# EAGLE design PLC_32u4_REV-A (EAGLE 8.6.3)
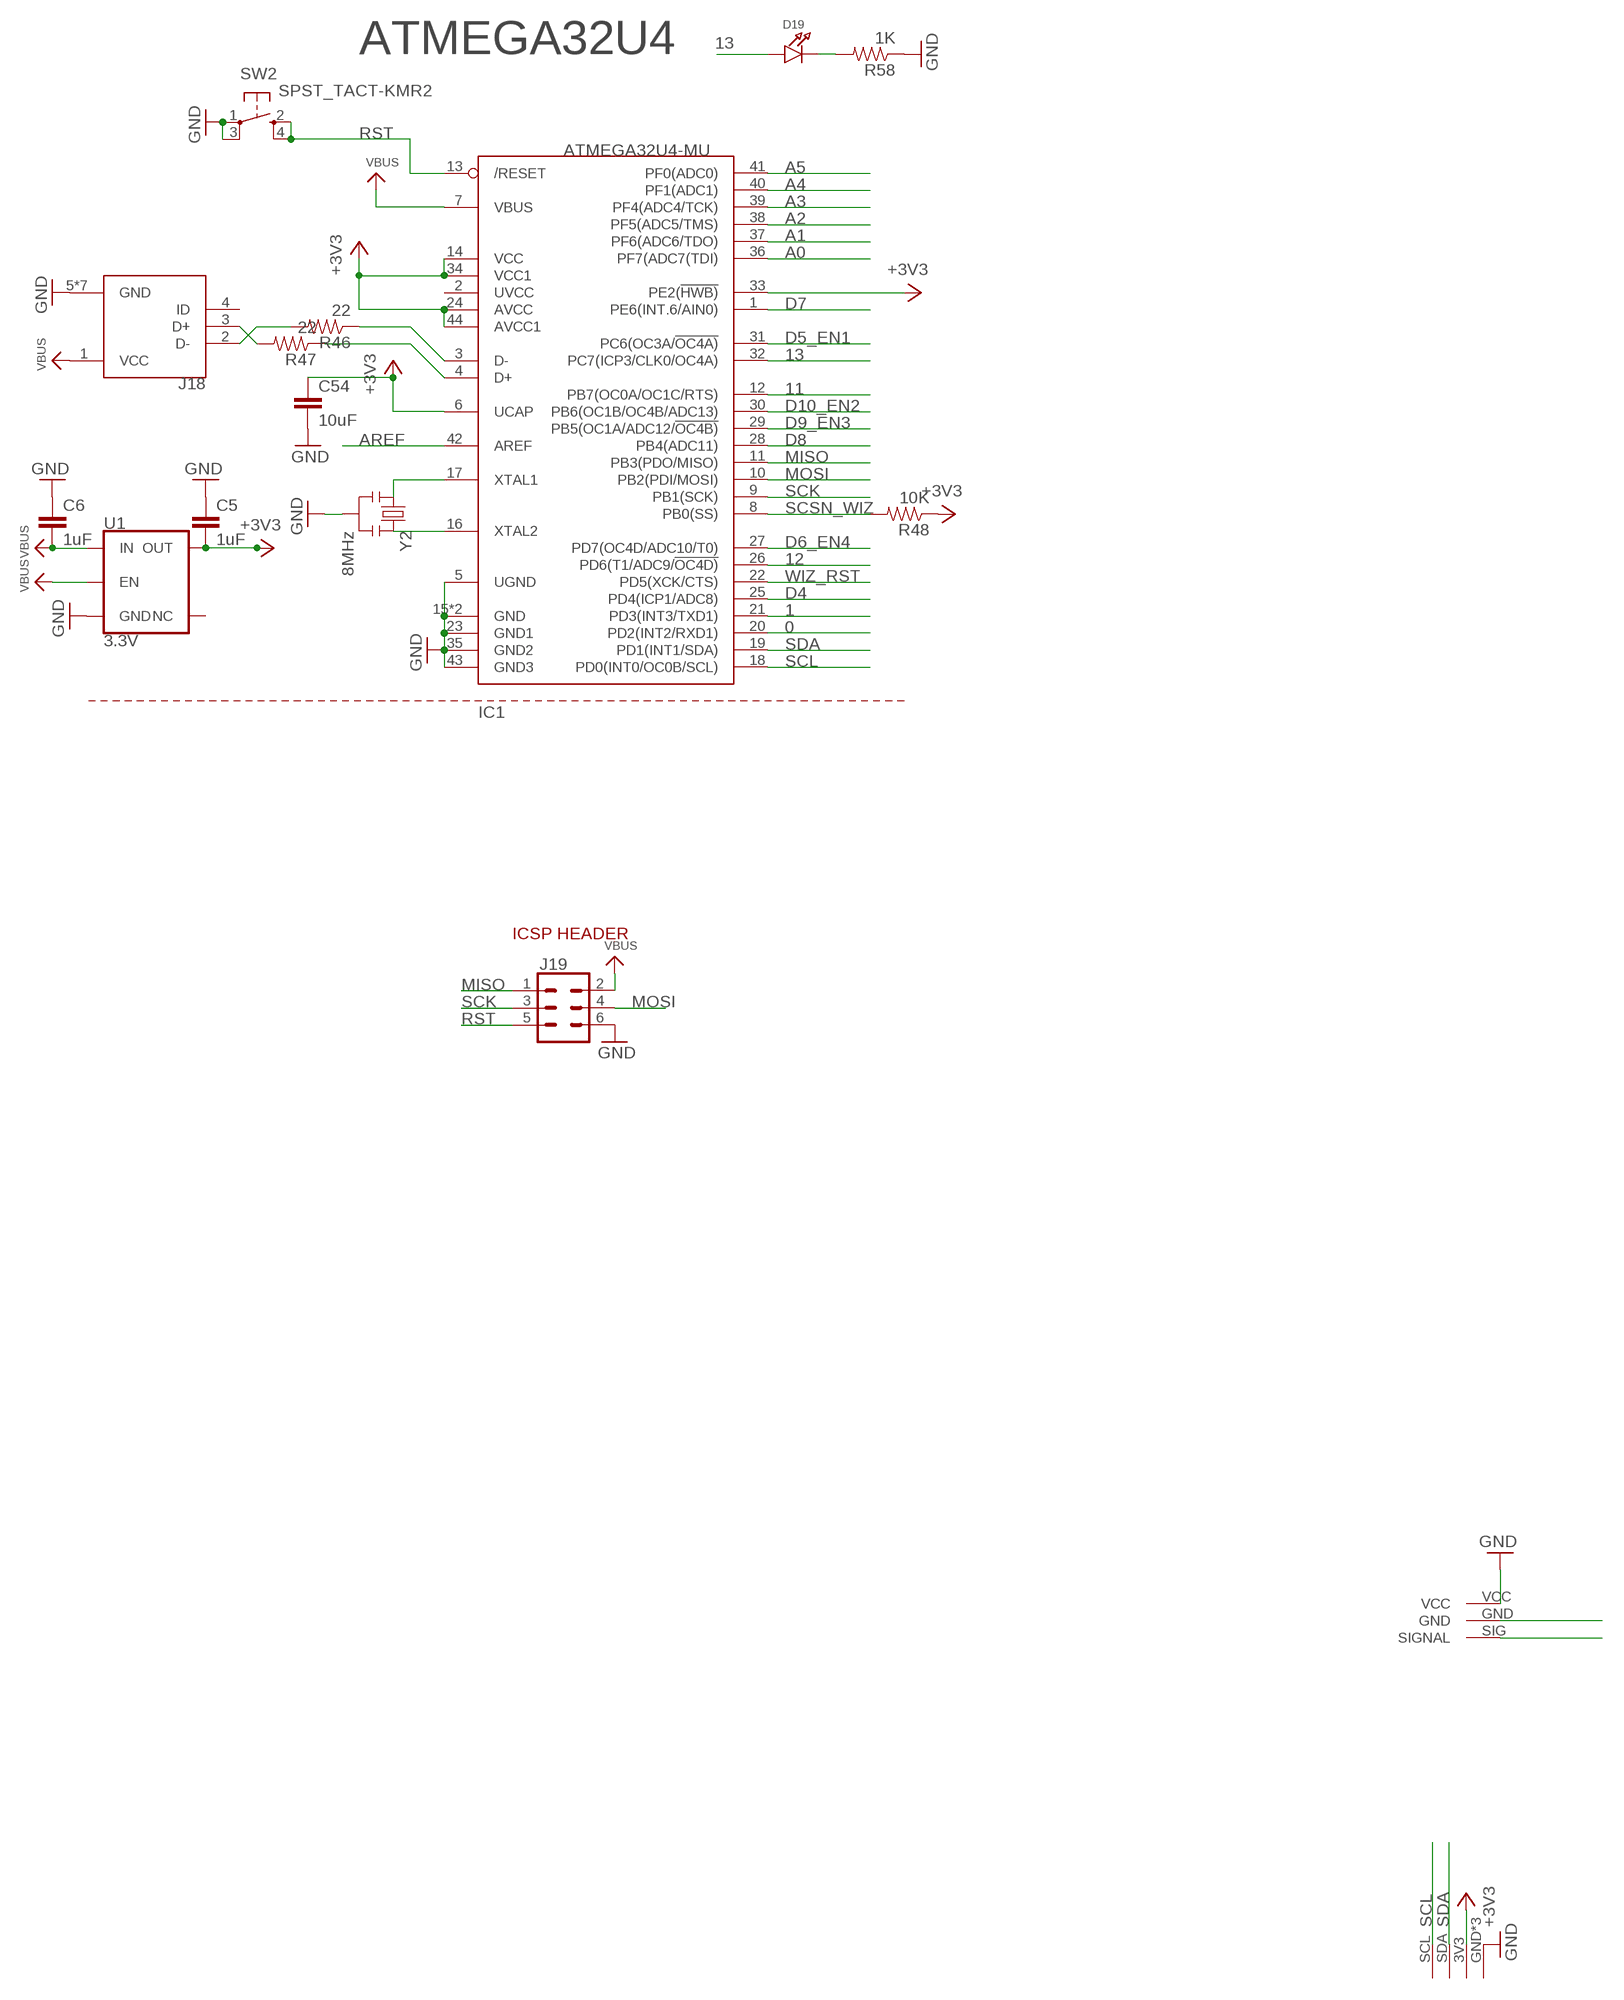
[diagram p0: schematic, sheet 1, part 1 of 2]
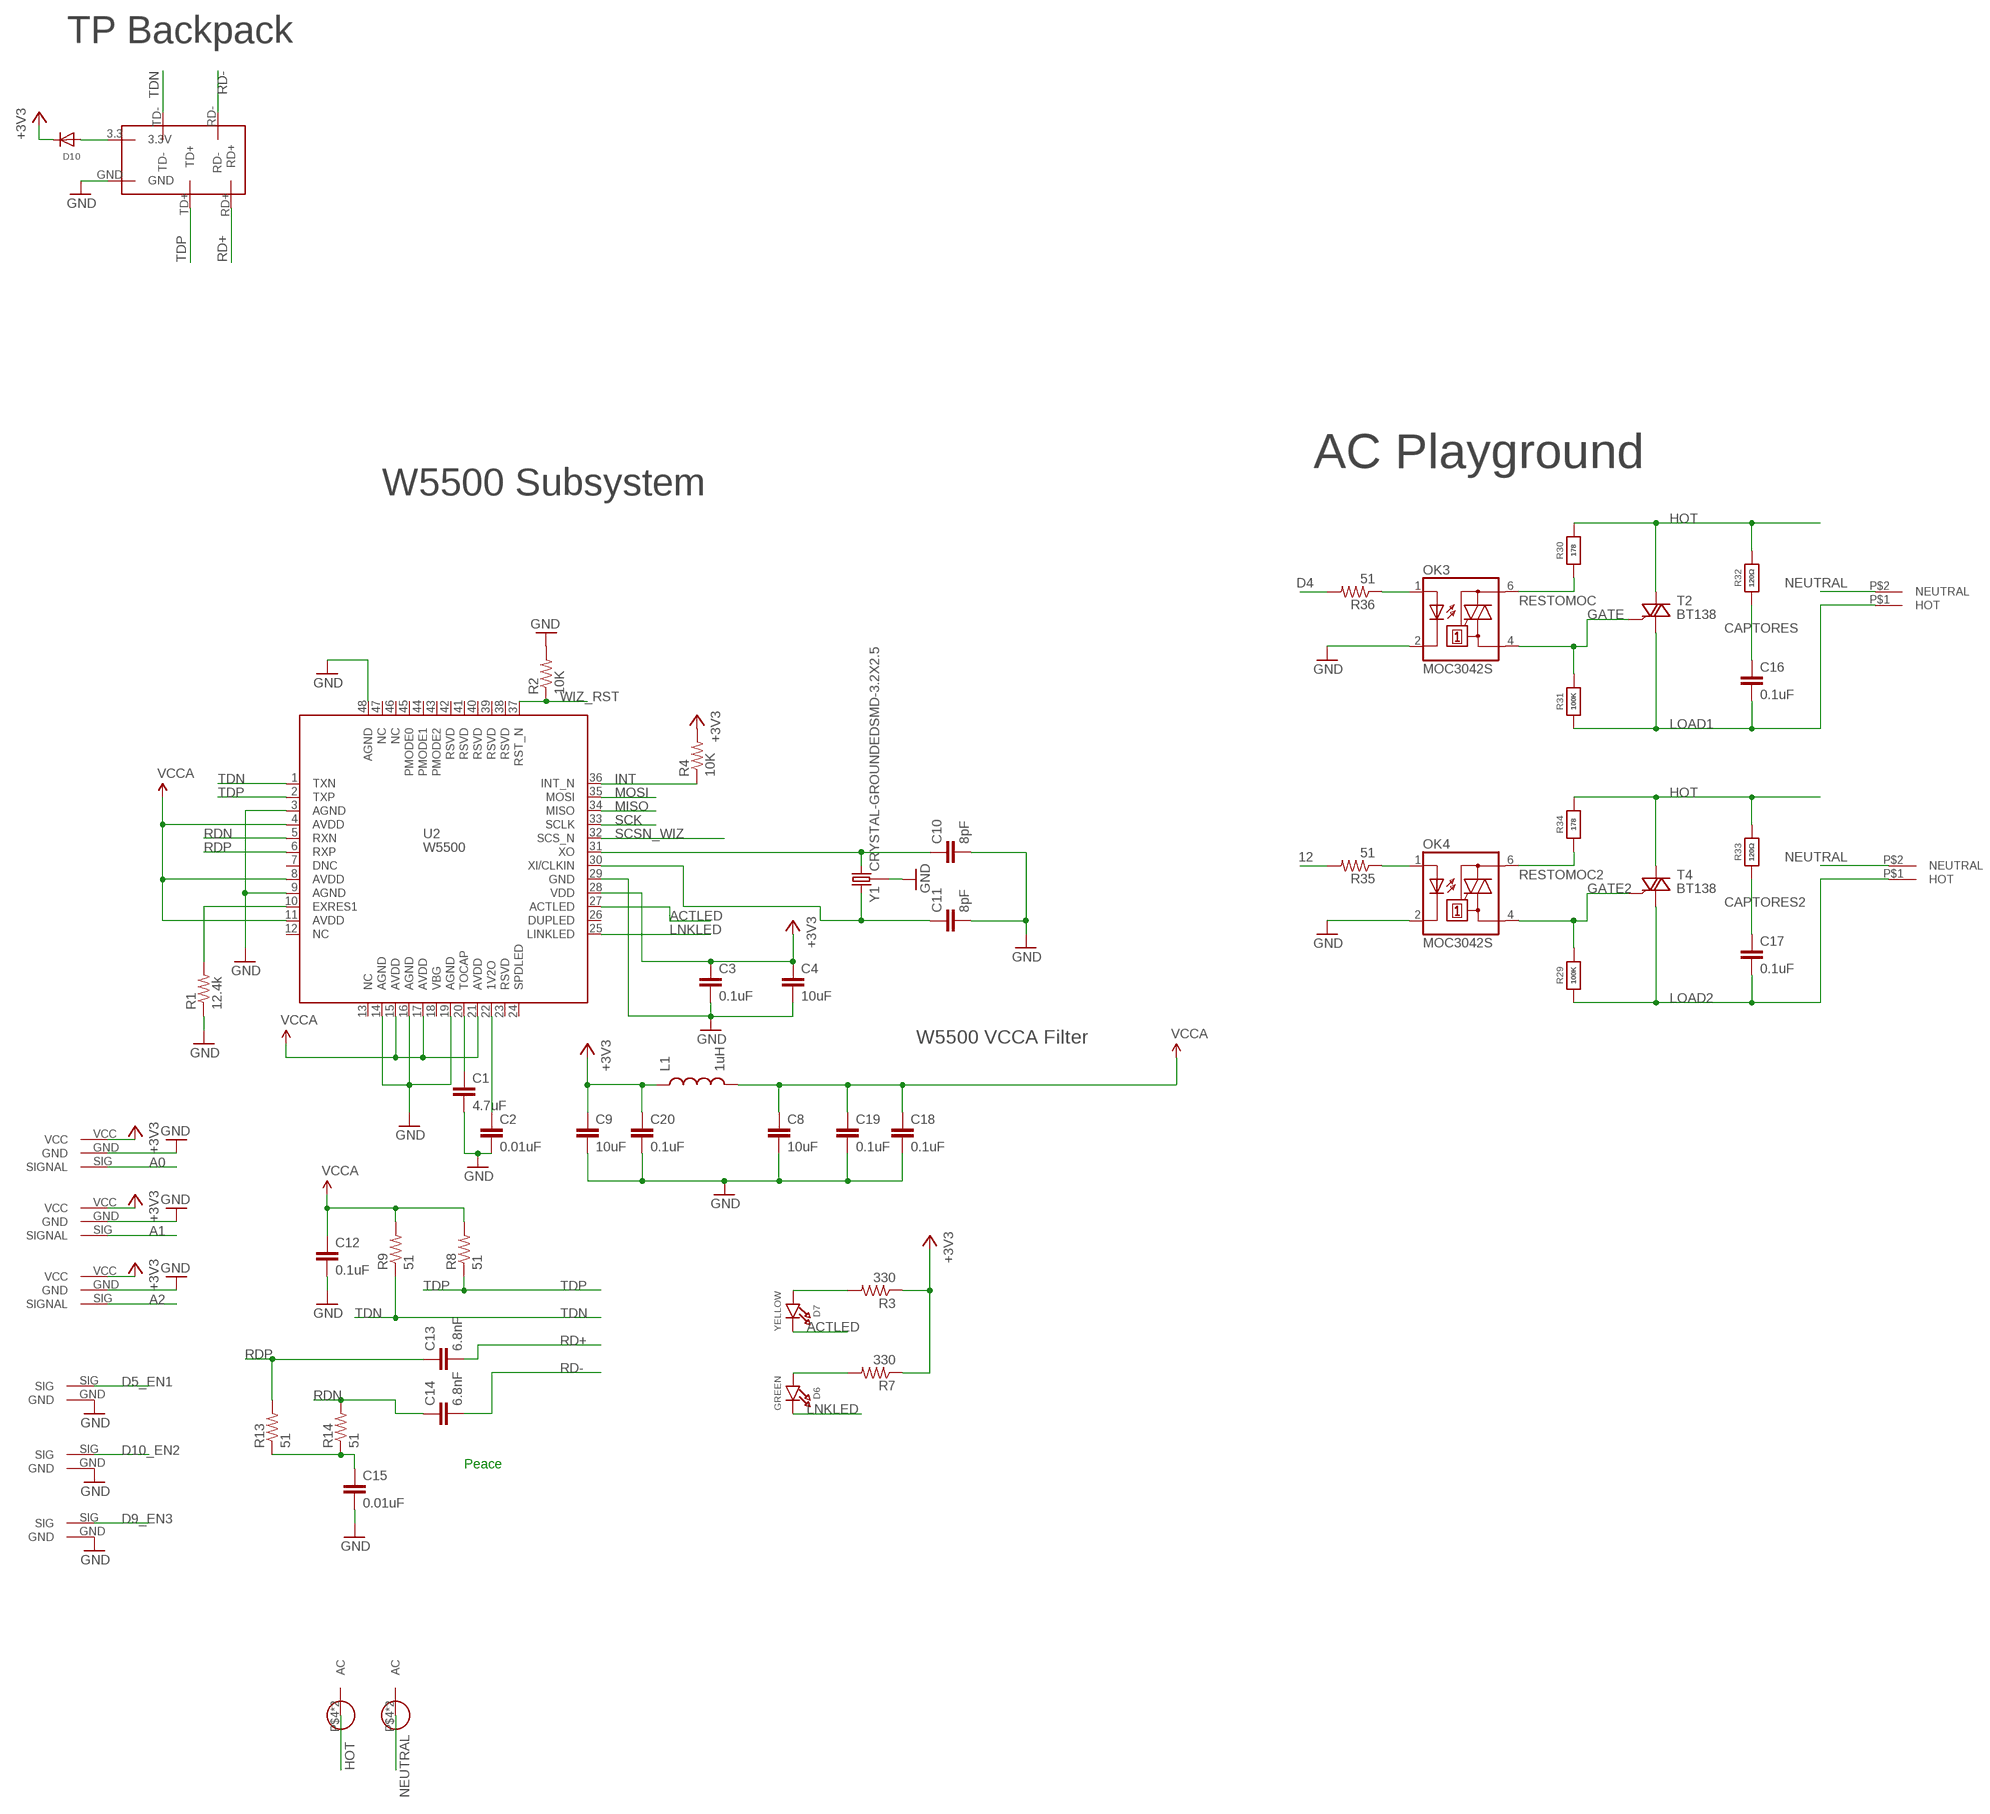
[diagram p1: schematic, sheet 1, part 2 of 2]

## Parts
C1  4.7uF  CAP0603-CAP  [0603-CAP]
C2  0.01uF  CAP0603-CAP  [0603-CAP]
C3  0.1uF  CAP0603-CAP  [0603-CAP]
C4  10uF  CAP0603-CAP  [0603-CAP]
C5  1uF  CAP0603-CAP  [0603-CAP]
C6  1uF  CAP0603-CAP  [0603-CAP]
C8  10uF  CAP0603-CAP  [0603-CAP]
C9  10uF  CAP0603-CAP  [0603-CAP]
C10  8pF  CAP0603-CAP  [0603-CAP]
C11  8pF  CAP0603-CAP  [0603-CAP]
C12  0.1uF  CAP0603-CAP  [0603-CAP]
C13  6.8nF  CAP0603-CAP  [0603-CAP]
C14  6.8nF  CAP0603-CAP  [0603-CAP]
C15  0.01uF  CAP0603-CAP  [0603-CAP]
C16  0.1uF  CAP1210  [1210]
C17  0.1uF  CAP1210  [1210]
C18  0.1uF  CAP0603-CAP  [0603-CAP]
C19  0.1uF  CAP0603-CAP  [0603-CAP]
C20  0.1uF  CAP0603-CAP  [0603-CAP]
C54  10uF  CAP0603-CAP  [0603-CAP]
D6  GREEN  LED0603_NOOUTLINE  [CHIPLED_0603_NOOUTLINE]
D7  YELLOW  LED0603_NOOUTLINE  [CHIPLED_0603_NOOUTLINE]
D10  DIODESOD-123  [SOD-123]
D19  LED0805_NOOUTLINE  [CHIPLED_0805_NOOUTLINE]
IC1  ATMEGA32U4-MU  [TQFN44_7MM]
J18  10103594-0001LF  [FCI_10103594-0001LF]
J19  CONN_03X2NO_SILK  [2X3-NS]
L1  1uH  INDUCTOR0603  [0603]
OK3  MOC3042S  [DIL6-SMD]
OK4  MOC3042S  [DIL6-SMD]
R1  12.4k  RESISTOR0603-RES  [0603-RES]
R2  10K  RESISTOR0603-RES  [0603-RES]
R3  330  RESISTOR0603-RES  [0603-RES]
R4  10K  RESISTOR0603-RES  [0603-RES]
R7  330  RESISTOR0603-RES  [0603-RES]
R8  51  RESISTOR0603-RES  [0603-RES]
R9  51  RESISTOR0603-RES  [0603-RES]
R13  51  RESISTOR0603-RES  [0603-RES]
R14  51  RESISTOR0603-RES  [0603-RES]
R29  100K  RESISTOR0805_10MGAP  [0805_10MGAP]
R30  178  RESISTOR0805_10MGAP  [0805_10MGAP]
R31  100K  RESISTOR0805_10MGAP  [0805_10MGAP]
R32  120Ω  RESISTOR0805_10MGAP  [0805_10MGAP]
R33  120Ω  RESISTOR0805_10MGAP  [0805_10MGAP]
R34  178  RESISTOR0805_10MGAP  [0805_10MGAP]
R35  51  RESISTOR0603-RES  [0603-RES]
R36  51  RESISTOR0603-RES  [0603-RES]
R46  22  RESISTOR0603-RES  [0603-RES]
R47  22  RESISTOR0603-RES  [0603-RES]
R48  10K  RESISTOR0603-RES  [0603-RES]
R58  1K  RESISTOR0603-RES  [0603-RES]
SW2  SPST_TACT-KMR2  [KMR2]
T2  BT138  [D2PAK-3]
T4  BT138  [D2PAK-3]
U1  3.3V  V_REG_AP2112K-3.3V  [SOT23-5]
U2  W5500  [W5500]
U$3  4P_JST_MINI_MICRO  [4P_JST1.0]
U$4  JST_MINI_MICRO  [3P_JST1.0]
U$15  TPLINK_BACKPACKMINIMAL_HOLES  [BACKPACK_MINIMAL_HOLES]
U$22  AC_BLADE  [AC_BLADE]
U$23  AC_BLADE  [AC_BLADE]
U$24  AC_TERMINAL  [AC_TERMINAL]
U$25  AC_TERMINAL  [AC_TERMINAL]
U$26  JST_MINI_MICRO  [3P_JST1.0]
U$27  JST_MINI_MICRO  [3P_JST1.0]
U$28  JST_MINI_MICRO  [3P_JST1.0]
U$29  2P_JST_MINI_MICRO  [2P_JST1.0]
U$30  2P_JST_MINI_MICRO  [2P_JST1.0]
U$31  2P_JST_MINI_MICRO  [2P_JST1.0]
Y1  CRYSTAL-GROUNDEDSMD-3.2X2.5  [CRYSTAL-SMD-3.2X2.5MM]
Y2  8MHz  RESONATORSMD  [RESONATOR-SMD]

## Nets
0: IC1.20(PD2(INT2/RXD1)) U$4.GND
1: IC1.21(PD3(INT3/TXD1)) U$4.SIG(SIGNAL)
11: IC1.12(PB7(OC0A/OC1C/RTS))
12: IC1.26(PD6(T1/ADC9/!OC4D)) R35.2
13: D19.A IC1.32(PC7(ICP3/CLK0/OC4A))
+3V3: C3.1 C4.1 C5.2 C9.1 C20.1 C54.1 D10.C IC1.6(UCAP) IC1.14(VCC) IC1.24(AVCC) IC1.33(PE2(!HWB)) IC1.34(VCC1) IC1.44(AVCC1) L1.1 R3.1 R4.2 R7.1 R48.1 U1.5(OUT) U2.28(VDD) U$3.3V3 U$26.VCC U$27.VCC U$28.VCC
A0: IC1.36(PF7(ADC7(TDI)) U$28.SIG(SIGNAL)
A1: IC1.37(PF6(ADC6/TDO)) U$26.SIG(SIGNAL)
A2: IC1.38(PF5(ADC5/TMS)) U$27.SIG(SIGNAL)
A3: IC1.39(PF4(ADC4/TCK))
A4: IC1.40(PF1(ADC1))
A5: IC1.41(PF0(ADC0))
ACTLED: D7.C U2.27(ACTLED)
AREF: IC1.42(AREF)
CAPTORES: C16.1 R32.1
CAPTORES2: C17.1 R33.1
D4: IC1.25(PD4(ICP1/ADC8)) R36.2
D5_EN1: IC1.31(PC6(OC3A/!OC4A)) U$31.SIG
D6_EN4: IC1.27(PD7(OC4D/ADC10/T0))
D7: IC1.1(PE6(INT.6/AIN0))
D8: IC1.28(PB4(ADC11))
D9_EN3: IC1.29(PB5(OC1A/ADC12/!OC4B)) U$29.SIG
D10_EN2: IC1.30(PB6(OC1B/OC4B/ADC13)) U$30.SIG
D+1: IC1.4(D+) R47.1
D-1: IC1.3(D-) R46.1
GATE: OK3.4(A1) R31.2 T2.G
GATE2: OK4.4(A1) R29.2 T4.G
GND: C1.2 C2.2 C3.2 C4.2 C5.1 C6.1 C8.2 C9.2 C10.2 C11.2 C12.2 C15.2 C18.2 C19.2 C20.2 C54.2 IC1.5(UGND) IC1.15(GND) IC1.23(GND1) IC1.35(GND2) IC1.43(GND3) IC1.THERMAL(GND) J18.5(GND) J18.P1(GND) J18.P2(GND) J18.P3(GND) J18.P4(GND) J18.P5(GND) J18.P6(GND) J19.6 OK3.2(C) OK4.2(C) R1.1 R2.2 R58.1 SW2.1(P) SW2.3(P1) U1.2(GND) U2.3(AGND) U2.9(AGND) U2.14(AGND) U2.16(AGND) U2.19(AGND) U2.29(GND) U2.48(AGND) U$3.GND U$3.P$4(GND) U$3.P$5(GND) U$4.VCC U$15.GND U$26.GND U$27.GND U$28.GND U$29.GND U$30.GND U$31.GND Y1.2 Y1.4 Y2.2
HOT: R30.2 R32.2 R33.2 R34.2 T2.A2 T4.A2 U$22.P$4(AC) U$22.P$5(AC)
INT: R4.1 U2.36(INT_N)
LNKLED: D6.C U2.25(LINKLED)
LOAD1: C16.2 R31.1 T2.A1 U$25.P$1(HOT)
LOAD2: C17.2 R29.1 T4.A1 U$24.P$1(HOT)
MISO: IC1.11(PB3(PDO/MISO)) J19.1 U2.34(MISO)
MOSI: IC1.10(PB2(PDI/MOSI)) J19.4 U2.35(MOSI)
N$1: C1.1 U2.20(TOCAP)
N$4: C2.1 U2.22(1V2O)
N$6: R1.2 U2.10(EXRES1)
N$7: D7.A R3.2
N$9: D6.A R7.2
N$11: C15.1 R13.1 R14.1
N$14: C10.1 U2.31(XO) Y1.3
N$17: C11.1 U2.30(XI/CLKIN) Y1.1
N$18: OK3.1(A) R36.1
N$19: OK4.1(A) R35.1
N$22: D10.A U$15.3.3(3.3V)
N$38: IC1.16(XTAL2) Y2.3
N$39: IC1.17(XTAL1) Y2.1
N$40: J18.3(D+) R47.2
N$41: J18.2(D-) R46.2
N$46: D19.C R58.2
NEUTRAL: U$23.P$4(AC) U$23.P$5(AC) U$24.P$2(NEUTRAL) U$25.P$2(NEUTRAL)
RD+: C13.2 U$15.RD+
RD-: C14.2 U$15.RD-
RDN: C14.1 R14.2 U2.5(RXN)
RDP: C13.1 R13.2 U2.6(RXP)
RESTOMOC: OK3.6(A2) R30.1
RESTOMOC2: OK4.6(A2) R34.1
RST: IC1.13(/RESET) J19.5 SW2.2(S) SW2.4(S1)
SCK: IC1.9(PB1(SCK)) J19.3 U2.33(SCLK)
SCL: IC1.18(PD0(INT0/OC0B/SCL)) U$3.SCL
SCSN_WIZ: IC1.8(PB0(SS)) R48.2 U2.32(SCS_N)
SDA: IC1.19(PD1(INT1/SDA)) U$3.SDA
TDN: R9.1 U2.1(TXN) U$15.TD-
TDP: R8.1 U2.2(TXP) U$15.TD+
VBUS: C6.2 IC1.7(VBUS) J18.1(VCC) J19.2 U1.1(IN) U1.3(EN)
VCCA: C8.1 C12.1 C18.1 C19.1 L1.2 R8.2 R9.2 U2.4(AVDD) U2.8(AVDD) U2.11(AVDD) U2.15(AVDD) U2.17(AVDD) U2.21(AVDD)
WIZ_RST: IC1.22(PD5(XCK/CTS)) R2.1 U2.37(RST_N)
Unconnected: IC1.2(UVCC) J18.4(ID) U1.4(NC) U2.7(DNC) U2.12(NC) U2.13(NC) U2.18(VBG) U2.23(RSVD) U2.24(SPDLED) U2.26(DUPLED) U2.38(RSVD) U2.39(RSVD) U2.40(RSVD) U2.41(RSVD) U2.42(RSVD) U2.43(PMODE2) U2.44(PMODE1) U2.45(PMODE0) U2.46(NC) U2.47(NC)

## Notes on the sheet
- ATMEGA32U4
- TP Backpack
- AC Playground
- W5500 Subsystem
- ICSP HEADER
- W5500 VCCA Filter
- Peace

## Library data of the parts
C1-C6 C8-C15 C18-C20 C54 = SparkFun-Passives:CAP: Capacitor Standard 0603 ceramic capacitor, and 0.1" leaded capacitor.
C16 C17 = SparkFun-Capacitors:CAP: Capacitor Standard 0603 ceramic capacitor, and 0.1" leaded capacitor.
D6 D7 D19 = microbuilder:LED: LED 0603 - 0603 Surface Mount Package 2mA: Green LED - Low Power (3.9mcd, 2ma, 1.7Vf) - Digikey: 475-2709-2-ND Orange LED - Low Power (9.8mcd, 2ma, 1.8Vf) - Digikey: 475-1194-2-ND Red LED - Low Power (5mcd, 2ma, 1.8Vf) - Digikey: 475-1195-2-ND Yellow LED - Low Power (7mcd, 2ma, 1.8Vf) - Digikey: 475-1196-2-ND 5mA: Blue LED - Low Power (17mcd, 5ma, 2.9Vf) - Digikey: LNJ937W8CRACT-ND 0805 - 0805 Surface Mount Package 2mA: Red LED (8.8mcd, 2mA, 1.8Vf, Clear) - Low Power [Digikey: 475-2510-1-ND] Green LED (5mcd, 2mA, 1.8Vf, Clear) - Low Power [Digikey: 475-2730-1-ND] Yellow LED (11.3mcd, 2mA, 1.8Vf, Clear) - Low Power [Digikey: 475-2555-1-ND] 20mA: Red LED (104mcd, 20mA, Diffused) - LS R976 [Digikey: 475-1278-6-ND] Red LED (12mcd, 20mA, 2.0Vf, Clear) - APT2012EC [Digikey: 754-1128-1-ND] Green LED (15mcd, 20mA, 2.2Vf, Clear) - APT2012GC [Digikey: 754-1131-1-ND] Orange LED (160mcd, 20mA, 2.1Vf, Clear) - APT2012SECK [Digikey: 754-1130-1-ND] 1206 - 1206 Surface Mount Package Green LED (26mcd, 20mA, Diffused) - LG N971 [Digikey: 475-1407-6-ND] Red LED (15mcd, 20mA, Diffused) - LH N974 [Digikey: 475-1416-6-ND] Cree - Cree High-Power Surface Mount LEDs XPEBWT-L1-0000-00D50 - White 111lm 350mA 2.9Vf 6200K 110° XTEAWT-00-0000-00000LEE3 - White 114lm 350mA 2.85Vf 5000K 115° Everlight - Everlight 45-21 Series Surface Mount LEDs 45-21/QK2C-B2832AC2CB2/2T - Warm White 2000mcd 20mA 3.25Vf 3050K 120° 45-21/LK2C-B38452C4CB2/2T - Nuetral White 2000mcd 20mA 3.25Vf 4150K 120° 45-21/LK2C-B50634C6CB2/2T - Cold White 2200mcd 20mA 3.25Vf 5650K 120° PLCC2 Reverse Mount LS T77K-J1L2-1-0-2-R18-Z - Red 11.25mcd 2mA 1.8Vf 630nm 120° LO T77K-L1M2-24-Z - Orange 19.6mcd 2mA 1.8Vf 606nm 120° LY T77K-K2M1-26-Z - Yellow 15.7mcd 2mA 1.8Vf 587nm 120°
D10 = adafruit:DIODE: Diode SMADIODE - SMA Surface Mount Package 20V 1A Schottky Diode Digikey: 641-1014-6-ND DO-1N4148 - Through Hole Small Current Diode SOD-123 20V 1 A (.5mV Vf) Schottky Diode - Digikey: MBRX120TPMSCT-ND SOD-323 10V 570mA (.38mV Vf, 3ns) Schottky Diode - Digikey: ZLLS410CT-ND SOD-523 30V 30mA Schottky Diode (RB751S-40TE61) - Digikey: RB751S-40TE61CT-ND SOT23-R/W - SOT23 Package (R = Solder Paste/Reflow Ovens, W = Hand-Soldering) BAT54Film 40V 300mA - Digikey: 497-7162-1-ND
IC1 = microbuilder:ATMEGA32U4: http://www.ladyada.net/library/eagle
J18 = 10103594-0001LF:10103594-0001LF: Conn Micro USB Type B RCP 5 POS 0.65mm Solder RA SMD 5 Terminal 1 Port T/R; AVAILABILITY: Good; DESCRIPTION: Conn Micro USB Type B RCP 5 POS 0.65mm Solder RA SMD 5 Terminal 1 Port T/R; MF: FCI; MP: 10103594-0001LF; PACKAGE: None; PRICE: 0.40 USD
J19 = SparkFun-Connectors:CONN_03X2: Multi connection point. Often used as Generic Header-pin footprint for 0.1 inch spaced/style header connections You can populate with any combo of single row headers, but if you'd like an exact match, check these: Header - 2x3 (Male, 0.1") <https://www.sparkfun.com/products/12807> (PRT-12807) Header - 2x3 (Female, 0.1") <https://www.sparkfun.com/products/13010> (PRT-13010) 2x3 Pin Shrouded Header <https://www.sparkfun.com/products/10877> (PRT-10877) On any of the 0.1 inch spaced packages, you can populate with these: Break Away Headers - Straight <https://www.sparkfun.com/products/116> (PRT-00116) Break Away Male Headers - Right Angle <https://www.sparkfun.com/products/553> (PRT-00553) Female Headers <https://www.sparkfun.com/products/115> (PRT-00115) Break Away Headers - Machine Pin <https://www.sparkfun.com/products/117> (PRT-00117) Break Away Female Headers - Swiss Machine Pin <https://www.sparkfun.com/products/743> (PRT-00743) Special note: the shrouded connector mates well with our 3x2 ribbon cables: Ribbon Crimp Connector - 6-pin (2x3, Female) <https://www.sparkfun.com/products/10651> (PRT-10651) Ribbon Cable - 6 wire (15ft) <https://www.sparkfun.com/products/10646> (PRT-10646)
L1 = SparkFun-Passives:INDUCTOR: Inductors Basic Inductor/Choke - 0603 and 1206. Footprints are not proven and vary greatly between part numbers. INDUCTOR POWER 3.3UH 4.0A SMD 0.197" L x 0.197" W x 0.177" H (5.00mm x 5.00mm x 4.50mm)
OK3 OK4 = optocoupler:MOC30*: 6-Pin DIP Zero-Cross Optoisolators Triac Driver Output (250/400 Volt Peak) Source: Data sheet <http://www.fairchildsemi.com/ds/MO/MOC3031M.pdf> The old path of data sheet not more available 2013-05-06.; MF: FAIRCHILD SEMICONDUCTOR; MPN: MOC3042SM; OC_FARNELL: unknown; OC_NEWARK: 34C1339
R1-R4 R7-R9 R13 R14 R35 R36 R46-R48 R58 = SparkFun-Passives:RESISTOR: Resistor Basic schematic elements and footprints for 0603, 1206, and PTH resistors.
R29-R34 = microbuilder:RESISTOR: Resistors For new designs, use the packages preceded by an '_' character since they are more reliable: The following footprints should be used on most boards: _0402 - Standard footprint for regular board layouts _0603 - Standard footprint for regular board layouts _0805 - Standard footprint for regular board layouts _1206 - Standard footprint for regular board layouts For extremely tight-pitch boards where space is at a premium, the following 'micro-pitch' footprints can be used (smaller pads, no silkscreen outline, etc.): _0402MP - Micro-pitch footprint for very dense/compact boards _0603MP - Micro-pitch footprint for very dense/compact boards _0805MP - Micro-pitch footprint for very dense/compact boards _1206MP - Micro-pitch footprint for very dense/compact boards
SW2 = adafruit:SPST_TACT: SMT 6mm switch, EVQQ2 series http://www.ladyada.net/library/eagle
T2 T4 = triac:BT138: TRIAC Source: http://www.semiconductors.philips.com BT138_SERIES_2.pdf
U1 = SparkFun-IC-Power:V_REG_AP2112: AP2112 - 600mA CMOS LDO Regulator w/ Enable The AP2112 is CMOS process low dropout linear regulator with enable function, the regulator delivers a guaranteed 600mA (min.) continuous load current. Features Output Voltage Accuracy: ±1.5% Output Current: 600mA (Min.) Foldback Short Current Protection: 50mA Enable Function to Turn ON/OFF VOUT Low Dropout Voltage (3.3V): 250mV (Typ.) @IOUT=600mA Excellent Load Regulation: 0.2%/A (Typ.) Excellent Line Regulation: 0.02%/V (Typ.) Low Quiescent Current: 55μA (Typ.) Low Standby Current: 0.01μA (Typ.) Low Output Noise: 50μVRMS PSRR: 100Hz -65dB, 1kHz -65dB OTSD Protection Stable with 1.0μF Flexible Cap: Ceramic, Tantalum and Aluminum Electrolytic Operation Temperature Range: -40°C to 85°C ESD: MM 400V, HBM 4000V; PROD_ID: VREG-12457
U2 = W5500:W5500
U$3 = Heep:4P_JST_MINI_MICRO
U$4 U$26-U$28 = Heep:JST_MINI_MICRO
U$15 = Heep:TPLINK_BACKPACK
U$22 U$23 = Heep:AC_BLADE
U$24 U$25 = Heep:AC_TERMINAL
U$29-U$31 = Heep:2P_JST_MINI_MICRO
Y1 = SparkFun-Clocks:CRYSTAL-GROUNDED: Crystals w/ Ground Pin (Generic) These are passive quartz crystals, which can be used as a clock source for a microcontroller. Crystal's are usually two-terminal devices. A third terminal may be optionally connected to ground, as recommended by the manufaturer.
Y2 = SparkFun:RESONATOR: Resonator Small SMD resonator. This is the itty bitty 10/20MHz resonators with built in caps. CSTCE10M0G55 and CSTCE20M0V53. Footprint has been reviewed closely but hasn't been tested yet.

## Board
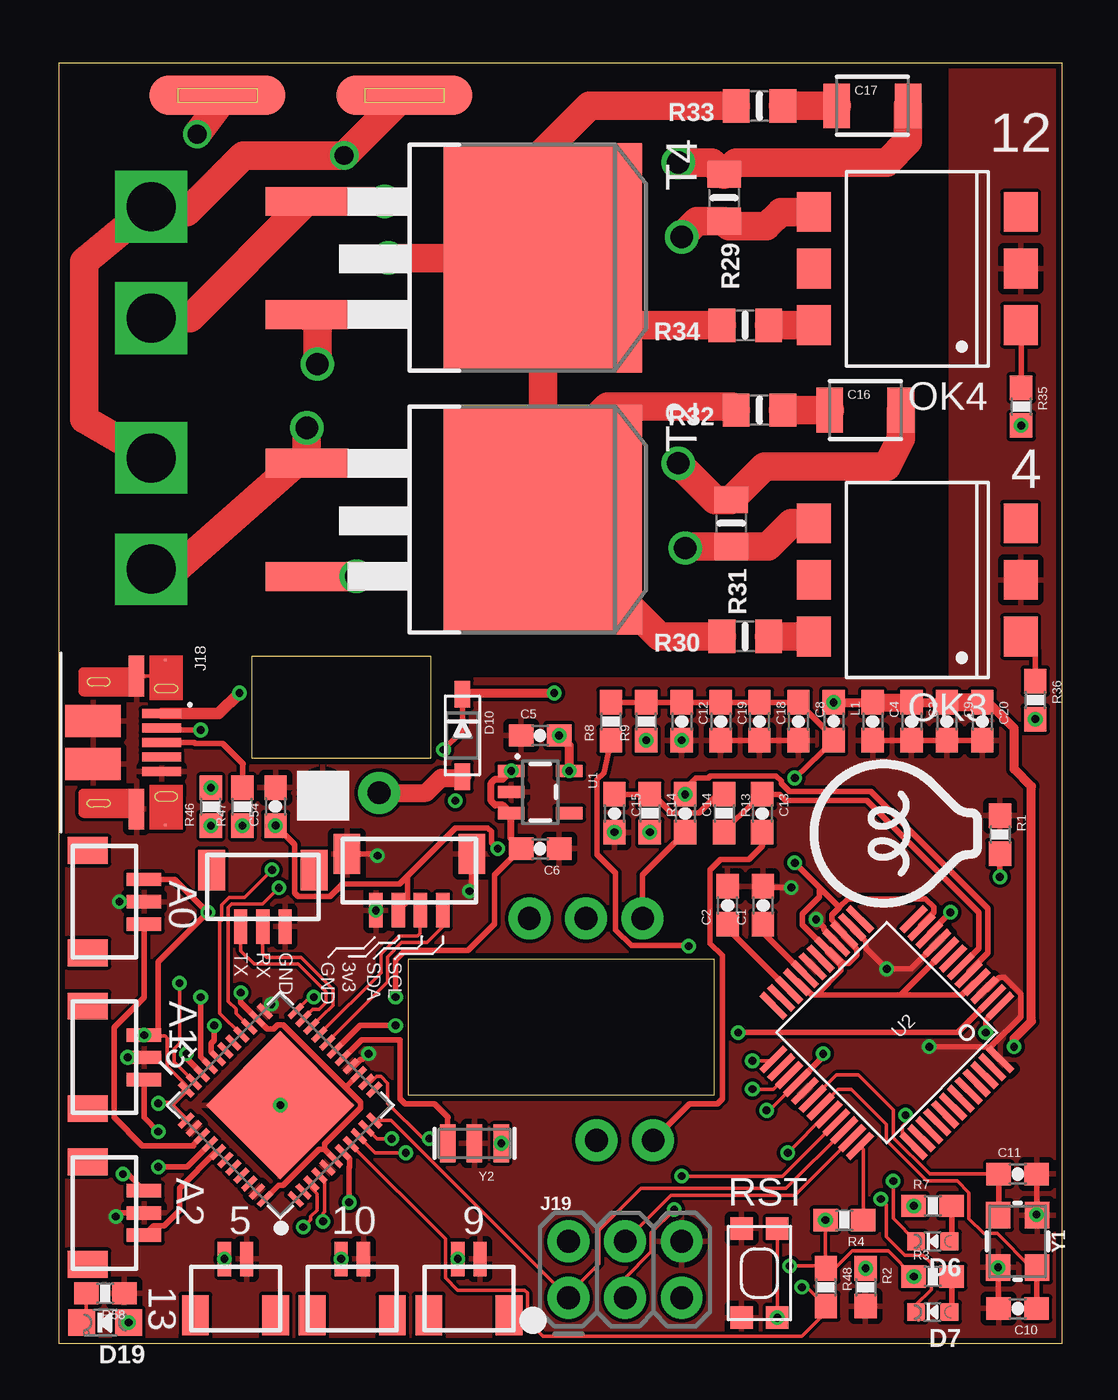
[diagram p2: board, top side]
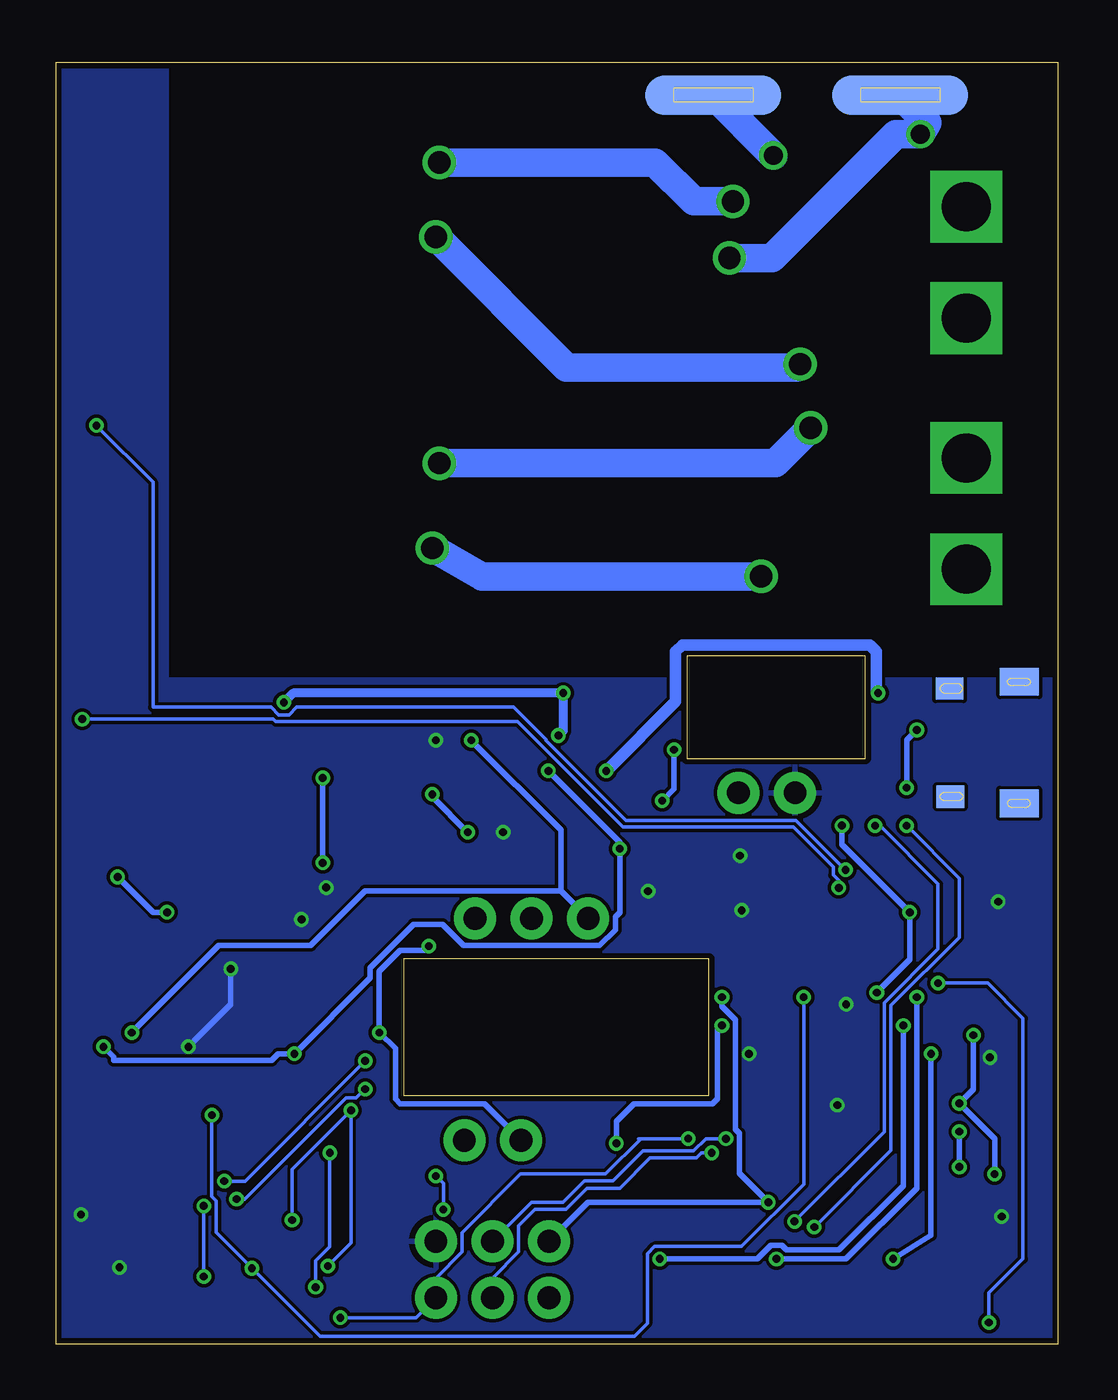
[diagram p3: board, bottom side, seen from below]

Size 45 x 57.5 mm. Coordinates in mm from the lower left corner, seen from the top.
Copper layers (1*16): Top 0.035mm / dielectric 1.5mm / Bottom 0.035mm
Design rules "SeeedStudio_2layer_DRU_no_angle_20140221": minimum track width 6mil, minimum drill 12mil, track to track 6mil, track to pad 6mil, pad to pad 6mil, via to via 6mil, smd to smd 0mil, copper to edge 10mil, drill to drill 10mil, minimum pad ring 10mil, minimum via ring 6mil, stop-mask expansion 2mil, vias tented up to drill 100mil, thermal gap 10mil

### Footprints (pad centres in the part's own frame; a part is rotated, then mirrored left to right if it is on the bottom)
0603-CAP = smd 1.1 x 1: 1 -0.85,0; 2 0.85,0
1210 = smd 1.2 x 2: 1 -1.6,0; 2 1.6,0
CHIPLED_0603_NOOUTLINE = smd 0.8 x 0.8: A 0,-0.75; C 0,0.75
SOD-123 = smd 1.2 x 0.7: A 1.85,0; C -1.85,0
CHIPLED_0805_NOOUTLINE = smd 1.2 x 1.2: A 0,-1.05; C 0,1.05
TQFN44_7MM = smd 0.25 x 0.8: 1 -2.5,-3.475; 2 -2,-3.475; 3 -1.5,-3.475; 4 -1,-3.475; 5 -0.5,-3.475; 6 0,-3.475; 7 0.5,-3.475; 8 1,-3.475; 9 1.5,-3.475; 10 2,-3.475; 11 2.5,-3.475; 23 2.5,3.475; 24 2,3.475; 25 1.5,3.475; 26 1,3.475; 27 0.5,3.475; 28 0,3.475; 29 -0.5,3.475; 30 -1,3.475; 31 -1.5,3.475; 32 -2,3.475; 33 -2.5,3.475 | smd 0.8 x 0.25: 12 3.475,-2.5; 13 3.475,-2; 14 3.475,-1.5; 15 3.475,-1; 16 3.475,-0.5; 17 3.475,0; 18 3.475,0.5; 19 3.475,1; 20 3.475,1.5; 21 3.475,2; 22 3.475,2.5; 34 -3.475,2.5; 35 -3.475,2; 36 -3.475,1.5; 37 -3.475,1; 38 -3.475,0.5; 39 -3.475,0; 40 -3.475,-0.5; 41 -3.475,-1; 42 -3.475,-1.5; 43 -3.475,-2; 44 -3.475,-2.5 | smd 4.7 x 4.7: THERMAL 0,0
FCI_10103594-0001LF = smd 0.4 x 1.75: 1 -1.3,2.825; 2 -0.65,2.825; 3 0,2.825; 4 0.65,2.825; 5 1.3,2.825 | smd 0.1 x 0.1: P1 -3.7,3; P2 3.7,3 | smd 1.825 x 0.7: P3 -2.987,1.7; P4 2.987,1.7 | smd 1.425 x 2.5: P5 -0.963,-0.25; P6 0.963,-0.25 | smd 1.25 x 1.75 bottom: P$1 -2.731,-0.026; P$2 2.726,-0.018 | smd 1 x 1.25 bottom: P$3 -2.422,3.111; P$4 2.427,3.078
2X3-NS = drill 1.016 pad 1.88: 1 -2.54,-1.27; 2 -2.54,1.27; 3 0,-1.27; 4 0,1.27; 5 2.54,-1.27; 6 2.54,1.27
0603 = smd 1.1 x 1: 1 -0.85,0; 2 0.85,0
DIL6-SMD = smd 1.78 x 1.52: 1 -2.54,-4.645; 2 0,-4.645; 3 2.54,-4.645; 4 2.54,4.645; 5 0,4.645; 6 -2.54,4.645
0603-RES = smd 1.1 x 1: 1 -0.85,0; 2 0.85,0
0805_10MGAP = smd 1.2 x 1.5: 1 -1.05,0; 2 1.05,0
KMR2 = smd 1 x 1: 1 2,0.8; 2 2,-0.8; 3 -2,0.8; 4 -2,-0.8
D2PAK-3 = smd 1.3 x 3.7: A1 0,0; G 5.08,0 | smd 10.3 x 8.9: A2 2.54,10.6
SOT23-5 = smd 0.55 x 1.2: 1 -0.95,-1.3; 2 0,-1.3; 3 0.95,-1.3; 4 0.95,1.3; 5 -0.95,1.3
W5500 = smd 1.5 x 0.3: 1 -4.45,2.75; 2 -4.45,2.25; 3 -4.45,1.75; 4 -4.45,1.25; 5 -4.45,0.75; 6 -4.45,0.25; 7 -4.45,-0.25; 8 -4.45,-0.75; 9 -4.45,-1.25; 10 -4.45,-1.75; 11 -4.45,-2.25; 12 -4.45,-2.75; 25 4.45,-2.75; 26 4.45,-2.25; 27 4.45,-1.75; 28 4.45,-1.25; 29 4.45,-0.75; 30 4.45,-0.25; 31 4.45,0.25; 32 4.45,0.75; 33 4.45,1.25; 34 4.45,1.75; 35 4.45,2.25; 36 4.45,2.75 | smd 0.3 x 1.5: 13 -2.75,-4.45; 14 -2.25,-4.45; 15 -1.75,-4.45; 16 -1.25,-4.45; 17 -0.75,-4.45; 18 -0.25,-4.45; 19 0.25,-4.45; 20 0.75,-4.45; 21 1.25,-4.45; 22 1.75,-4.45; 23 2.25,-4.45; 24 2.75,-4.45; 37 2.75,4.45; 38 2.25,4.45; 39 1.75,4.45; 40 1.25,4.45; 41 0.75,4.45; 42 0.25,4.45; 43 -0.25,4.45; 44 -0.75,4.45; 45 -1.25,4.45; 46 -1.75,4.45; 47 -2.25,4.45; 48 -2.75,4.45
4P_JST1.0 = smd 0.6 x 1.55: 3V3 -0.5,-2.04; GND -1.5,-2.04; SCL 1.5,-2.04; SDA 0.5,-2.04 | smd 1.2 x 1.8: P$4 2.8,0.485; P$5 -2.8,0.485
3P_JST1.0 = smd 0.6 x 1.55: GND 0,0; SIG -1,0; VCC 1,0 | smd 1.2 x 1.8: P$4 2.3,2.525; P$5 -2.3,2.525
BACKPACK_MINIMAL_HOLES = drill 1.016 pad 1.88: 3.3 14.357,24.729; GND 11.817,24.729; P$6 23.644,19.093; RD+ 26.658,9.132; RD- 26.184,19.093; TD+ 24.118,9.132; TD- 21.104,19.093
AC_BLADE = smd 6.096 x 1.778: P$4 0,0 | smd 6.096 x 1.778 bottom: P$5 0,0
AC_TERMINAL = drill 2.2 square: P$1 0,0; P$2 5,0
2P_JST1.0 = smd 0.6 x 1.55: GND 0,0; SIG 1,0 | smd 1.2 x 1.8: P$4 2.3,2.525; P$5 -1.3,2.525
CRYSTAL-SMD-3.2X2.5MM = smd 1.2 x 1.1: 1 -1.175,-0.875; 2 1.175,-0.875; 3 1.175,0.875; 4 -1.175,0.875
RESONATOR-SMD = smd 0.7 x 1.7: 1 -1.2,0; 2 0,0; 3 1.2,0

### Placement (x,y rotation side)
C1  31.58,19.68 90 top
C2  30,19.68 90 top
C3  38.25,27.94 270 top
C4  36.51,27.94 270 top
C5  21.58,27.3 0 top
C6  21.58,22.22 180 top
C8  33.17,27.94 270 top
C9  39.84,27.94 270 top
C10  43.01,1.59 180 top
C11  43.01,7.62 0 top
C12  27.93,27.94 270 top
C13  31.55,23.81 270 top
C14  28.09,23.81 270 top
C15  24.92,23.81 270 top
C16  36.18,41.91 0 top
C17  36.49,55.56 0 top
C18  31.43,27.94 270 top
C19  29.68,27.94 270 top
C20  41.43,27.94 270 top
C54  9.7,24.11 90 top
D6  39.2,4.6 90 top
D7  39.2,1.43 90 top
D10  18.09,27.3 270 top
D19  2.06,0.95 90 top
IC1  9.92,10.71 45 top
J18  1.76,26.99 270 top
J19  25.39,3.33 0 top
L1  34.76,27.94 270 top
OK3  38.51,34.29 90 top
OK4  38.51,48.26 90 top
R1  42.22,22.86 270 top
R2  36.19,2.54 270 top
R3  39.2,3.02 0 top
R4  35.24,5.56 180 top
R7  39.2,6.19 0 top
R8  24.76,27.94 90 top
R9  26.35,27.94 90 top
R13  29.84,23.81 270 top
R14  26.5,23.81 270 top
R29  29.84,51.43 270 top
R30  30.79,31.75 180 top
R31  30.16,36.83 270 top
R32  31.43,41.91 180 top
R33  31.43,55.56 180 top
R34  30.79,45.72 180 top
R35  43.17,42.07 270 top
R36  43.81,28.89 270 top
R46  6.8,24.11 90 top
R47  8.22,24.11 90 top
R48  34.4,2.54 270 top
R58  2.06,2.27 180 top
SW2  31.43,3.17 90 top
T2  11.11,39.53 270 top
T4  11.11,51.28 270 top
U1  21.58,24.76 270 top
U2  37.14,13.97 225 top
U$3  15.71,21.5 0 top
U$4  9.13,18.73 0 top
U$15  -0.01,0 0 top
U$22  7.1,56.04 0 top
U$23  15.48,56.04 0 top
U$24  4.12,46.04 90 top
U$25  4.12,34.77 90 top
U$26  3.8,12.86 90 top
U$27  3.8,5.87 90 top
U$28  3.8,19.84 90 top
U$29  18.88,3.81 180 top
U$30  13.65,3.81 180 top
U$31  8.41,3.81 180 top
U$32  [HEEPLOGOSMALL]  42.22,18.41 90 top
Y1  43.01,4.6 270 top
Y2  18.63,9 180 top

### Tracks (layer width: path | path; a pad name or v marks a point on that pad's centre or on a via)
0
  Top 0.152: IC1.20 11.78,14.7 12.28,15.2 12.28,15.91 10.85,17.35 9.31,17.35 9.13,17.53 U$4.GND
1
  Top 0.152: IC1.21 11.38,15 11.65,15 11.98,15.33 11.98,15.79 10.72,17.05 8.74,17.05 8.14,17.64 U$4.SIG
12  (via drill 0.35)
  Top 0.152: v9.54,21.27 8.31,20.04 7.61,20.04 7.28,19.71 7.28,19.01 7.2,18.93 7.2,14.84 IC1.26
  Bottom 0.152: R35.2 40.63,38.68 40.63,28.57 35.33,28.57 34.99,28.23 34.53,28.23 34.19,28.57 24.44,28.57 22.99,27.12 22.99,27.07 19.41,23.49 11.77,23.49 v9.54,21.27
  other vias: 43.17,41.22
13  (via drill 0.35)
  Top 0.152: v5.39,16.19 5.39,13.49 5.15,13.25 5.15,12.65 IC1.32
  Bottom 0.152: v5.39,16.19 3.17,16.19 1.58,14.6 1.58,3.81 3.11,2.28 D19.A
  other vias: 3.11,0.95
+3V3  (via drill 0.35)
  Top 0.152: IC1.33 5.69,11.61 4.85,12.45 4.85,13.72 4.76,13.81 4.44,13.81 3.85,13.81 U$26.VCC | R48.1 34.3,3.49 v32.78,3.49 | v31.74,10.48 31.88,10.48 U2.28 | R48.1 34.39,3.41 R4.2 | R48.1 34.82,3.39 35.59,4.17 37.2,4.17 R3.1
  Top 0.254: 41.59,28.89 41.05,28.89 C20.1 | D10.C 18.09,27.52 v17.24,26.67 | IC1.44 9.85,7.11 10.03,7.11 11.65,8.73 11.9,8.73 | 11.9,8.73 IC1.6 | IC1.14 12.84,11.51 | 11.9,8.73 11.9,8.98 13.52,10.6 13.52,10.83 12.84,11.51 | 4.44,13.81 4.44,17.14 v6.66,19.37 5.18,20.84 U$28.VCC | IC1.33 5.08,10.79 v4.44,10.79 4.92,10.79 IC1.34 | v2.85,7.62 3.06,7.62 U$27.VCC | 12.84,11.51 10.03,14.32 9.8,14.32 9.61,14.13 9.33,14.13 IC1.24 8.14,15.32 v8.14,15.77 | U2.28 34.28,12.88 v34.28,13.02 | U$3.3V3 15.63,19.88 15.63,21 | v19.68,22.22 19.39,22.51 19.39,23 19.23,23.16 17.79,23.16 15.63,21 | C54.1 10.55,22.41 10.55,20.24 10.72,20.08 12.15,20.08 12.71,20.64 15.27,20.64 15.63,21
  Top 0.406: D10.C 18.15,29.21 v22.22,29.21 | C5.2 22.88,26.85 U1.5 | L1.1 C4.1 | C3.1 C9.1 | v42.86,13.33 42.86,13.7 43.63,14.47 43.63,25.02 42.86,25.8 42.86,27.62 41.59,28.89
  Top 0.813: C4.1 C3.1 | C20.1 C9.1
  Bottom 0.152: v32.78,3.49 31.74,4.53 v31.74,10.48 34.39,7.83 R4.2 | R3.1 R7.1
  Bottom 0.254: v42.86,13.33 42.39,12.87 42.39,12.73 35.3,12.73 35.01,13.02 v34.28,13.02 30.88,16.42 30.88,16.88 28.93,18.83 27.64,18.83 26.68,17.87 20.59,17.87 19.88,18.59 19.88,19.17 19.68,19.37 v19.68,22.22 19.68,22.51 U1.5 | v17.24,26.67 17.24,24.9 v17.77,24.37 | v2.85,7.62 2.85,9.21 v4.44,10.79 3.8,11.43 U$26.VCC | v8.14,15.77 6.66,17.24 v6.66,19.37 9.7,22.41 C54.1
  Bottom 0.406: C5.2 22.22,27.52 v22.22,29.21 34.34,29.21 L1.1
  other vias: 38.35,6.19 38.35,3.02 22.43,27.3 34.76,28.79 22.88,25.71 3.8,13.86 34.39,5.56 9.7,23.26
A0
  Top 0.254: U$28.SIG 3.8,15.56 2.46,14.21 2.46,10.16 3.73,8.89 6.03,8.89 6.03,8.94 IC1.36
A1  (via drill 0.35)
  Top 0.254: U$26.SIG 3.8,10.16 v4.44,9.52 | v4.44,7.94 5.73,7.94 IC1.37
  Bottom 0.254: v4.44,9.52 v4.44,7.94
A2
  Top 0.254: U$27.SIG 4.22,5.29 4.69,5.29 5.39,5.99 5.39,6.98 7.02,8.61 IC1.38
ACTLED  (via drill 0.35)
  Top 0.152: v36.88,6.49 37.13,6.24 37.13,4.81 37.96,3.97 38.77,3.97 39.13,3.61 39.13,2.42 38.45,1.74 D7.C | v31.11,11.43 32.06,11.43 32.69,12.06 U2.27
  Bottom 0.152: v31.11,11.43 31.51,11.03 31.97,11.03 36.51,6.49 v36.88,6.49
CAPTORES
  Top 1.27: R32.1 C16.1
CAPTORES2
  Top 1.27: R33.1 C17.1
D4  (via drill 0.35)
  Top 0.152: IC1.25 7.93,14.82 7.93,15.03 7.58,15.37 7.58,19.58 7.74,19.74 9.12,19.74 v9.85,20.46
  Bottom 0.152: R36.2 35.23,28.04 35.12,27.93 24.28,27.93 19.54,23.19 11.89,23.19 10.1,21.4 10.1,21.04 9.85,20.79 v9.85,20.46
  other vias: 43.81,28.04
D5_EN1  (via drill 0.35)
  Top 0.254: IC1.31 5.71,12.8 v5.71,13.02
  Bottom 0.254: v5.71,13.02 5.71,4.87 U$31.SIG
  other vias: 7.41,3.81
D9_EN3  (via drill 0.35)
  Top 0.254: v6.95,14.29 6.95,13.62 6.81,13.48 6.81,13.11 IC1.29
  Bottom 0.254: U$29.SIG 13.5,3.81 12.9,4.42 12.39,4.42 12.19,4.22 9.84,4.22 6.95,7.1 v6.95,14.29
  other vias: 17.88,3.81
D10_EN2  (via drill 0.35)
  Top 0.254: IC1.30 6.34,12.87 v6.34,15.56
  Bottom 0.254: U$30.SIG 9.52,3.81 6.34,6.98 v6.34,15.56
  other vias: 12.65,3.81
D+1  (via drill 0.35)
  Top 0.152: IC1.4 11.68,7.55 11.91,7.32 11.91,5.92 11.84,5.85 v11.84,5.49
  Bottom 0.152: R47.1 8.01,23.26 5.39,20.64 5.39,17.73 7.81,15.31 7.81,9.52 v11.84,5.49
  other vias: 8.22,23.26
D-1  (via drill 0.35)
  Top 0.152: IC1.3 11.31,6.99 11.56,6.74 11.56,6 11.28,5.72 11.28,5.57 v10.95,5.24
  Bottom 0.152: R46.1 4.44,20.89 4.44,18.25 7.51,15.18 7.51,8.68 v10.95,5.24
  other vias: 6.8,23.26
GATE  (via drill 1)
  Top 1.27: T2.G v13.33,34.45 | v28.09,35.72 28.15,35.78 R31.2 31.8,35.78 32.85,36.83 OK3.4
  Bottom 1.27: v13.33,34.45 25.87,34.45 v28.09,35.72
GATE2  (via drill 1)
  Top 1.27: OK4.4 32.38,50.8 31.74,50.16 30.06,50.16 R29.2 28.63,50.38 v27.93,49.69 | v11.58,43.97 11.58,45.72 T4.G
  Bottom 1.27: v27.93,49.69 22.06,43.81 11.74,43.81 v11.58,43.97
GND  (via drill 0.35)
  Top 0.152: IC1.23 v9.52,15.24 | Y1.4 v43.86,5.8 | J18.P1 4.05,29.97 J18.P3
  Top 0.254: C19.2 C18.2 C8.2 | C4.2 C3.2 C9.2 C20.2 | 41.84,13.36 41.74,13.26 U2.48 | U2.3 41.62,15.88 42.19,16.44 42.42,16.44 43.15,15.71 43.15,14.67 41.84,13.36 | C11.2 v43.86,5.8 | Y1.2 42.14,1.61 C10.2 | U2.14 35.59,18.67 36.2,18.06 36.2,17.77 v37.14,16.83 38.23,16.83 U2.9 | v39.05,13.33 41.81,13.33 41.84,13.36 | U2.16 34.88,18.03 34.32,18.59 34.32,18.7 v33.97,19.05 | v32.85,20.48 31.64,20.48 C1.2 | U$27.GND 2.69,5.87 v2.53,5.71 | U$26.GND v3.06,12.86 | U$28.GND v2.69,19.84 | IC1.15 13.21,12.46 13.51,12.76 13.62,12.76 v13.88,13.02 | U$3.P$5 14.21,21.98 v14.28,21.91 | U$3.P$4 18.51,20.42 v18.41,20.32
  Bottom 0.254: v37.14,16.83 37.14,15.24 v39.05,13.33 | C15.2 24.97,22.96 25.08,22.86
  other vias: 27.93,27.09 24.92,22.96 9.92,10.71 42.14,3.43 14.21,19.46
  pour Top: -2.86,29.84 -2.86,-1.59 48.89,-1.59 48.89,58.74 40,58.74 40,29.84
  pour Bottom: -2.86,29.84 -2.86,-1.59 50.16,-1.59 50.16,58.1 40,58.1 40,29.84
HOT  (via drill 0.85, 1)
  Top 1.27: U$22.P$5 7.1,55.52 v6.18,54.29 | R30.2 26.94,31.75 T2.A2 | T2.A2 21.71,39.17 24.6,42.07 30.22,42.07 R32.2 | T2.A2 T4.A2 | R34.2 24.72,45.72 T4.A2 | R33.2 23.81,55.56 21.74,53.5 21.74,48.77 T4.A2 | T4.A2 v14.76,48.74
  Bottom 1.27: U$22.P$5 5.87,54.81 v6.18,54.29 7.3,54.29 12.85,48.74 v14.76,48.74
INT
  Top 0.152: R4.1 36.09,8.73 U2.36
LNKLED  (via drill 0.35)
  Top 0.152: U2.25 31.98,12.7 v31.11,12.7 | v37.43,7.3 37.43,5.62 D6.C
  Bottom 0.152: v31.11,12.7 36.51,7.3 v37.43,7.3
LOAD1  (via drill 1)
  Top 1.27: C16.2 37.78,40.64 37.14,39.37 31.65,39.37 R31.1 29.42,37.88 v27.77,39.53 | U$25.P$1 5.23,34.77 10.63,39.53 T2.A1 v11.11,41.12
  Bottom 1.27: v27.77,39.53 12.69,39.53 v11.11,41.12
LOAD2  (via drill 1)
  Top 1.27: C17.2 38.09,53.97 37.14,53.02 30.38,53.02 R29.1 29.3,53.02 v27.77,53.02 | v14.6,51.28 T4.A1 5.87,46.04 U$24.P$1
  Bottom 1.27: v14.6,51.28 16.34,51.28 18.09,53.02 v27.77,53.02
MISO
  Top 0.152: IC1.11 14.88,10.02 16.99,7.92 17,7.92 J19.1 22.85,2.22 24.23,3.59 24.23,5.09 26.11,6.97 32.62,6.97 U2.34
MOSI  (via drill 0.35)
  Top 0.152: IC1.10 14.25,9.21 v14.92,9.21 | U2.35 33.02,6.67 27.46,6.67 J19.4
  Bottom 0.152: v14.92,9.21 15.82,9.21 16.37,8.65 18.65,8.65 19.98,7.31 21.25,7.31 22.22,6.35 23.65,6.35 J19.4
N$1
  Top 0.254: C1.1 31.43,18.62 U2.20
N$4
  Top 0.254: U2.22 30,18.64 C2.1
N$6  (via drill 0.35)
  Top 0.254: U2.10 39.05,18.42 v40,19.37 | v42.22,20.95 R1.2
  Bottom 0.254: v40,19.37 40.63,19.37 v42.22,20.95
N$7
  Top 0.254: R3.2 40.05,1.53 D7.A
N$9
  Top 0.254: R7.2 40.05,4.7 D6.A
N$11
  Top 0.254: R13.1 29.54,24.66 28.71,23.83 27.48,23.83 26.65,24.66 R14.1 C15.1
N$14
  Top 0.152: Y1.3 43.61,3.43 42.09,4.95 41.5,4.95 40.83,5.61 40.83,6.79 40.3,7.31 38.94,7.31 37.13,9.13 37.13,9.85 35.55,11.43 34.95,11.43 U2.31
  Top 0.254: C10.1 43.86,3.4 Y1.3
N$17
  Top 0.152: C11.1 39.07,7.62 37.43,9.25 37.43,10.5 35.87,12.06 34.88,12.06 U2.30
  Top 0.254: C11.1 42.16,5.8 Y1.1
N$18
  Top 0.254: R36.1 43.81,31.09 OK3.1
N$19
  Top 0.254: 42.86,45.42 OK4.1 43.17,45.7 R35.1
N$22
  Top 0.813: U$15.3.3 16.47,24.73 17.14,25.4 18.04,25.4 D10.A
N$38
  Top 0.254: IC1.16 13.56,13.65 15.29,13.65 15.29,11 15.52,10.77 16.84,10.77 17.46,10.16 17.43,10.14 Y2.3
N$39  (via drill 0.35)
  Top 0.254: IC1.17 13.49,14.29 v15.09,14.29
  Bottom 0.254: Y2.1 19.83,9.98 19.04,10.77 15.52,10.77 15.29,11 15.29,14.09 v15.09,14.29
  other vias: 19.83,9
N$40
  Top 0.254: J18.3 6.05,26.99 6.09,26.95 7.34,26.95 8.25,26.03 8.22,26 R47.2
N$41  (via drill 0.35)
  Top 0.254: J18.2 4.67,27.55 v6.34,27.55
  Bottom 0.254: v6.34,27.55 6.8,27.09 R46.2
  other vias: 6.8,24.96
N$46
  Top 0.152: D19.C 1.21,1.16 R58.2
NEUTRAL  (via drill 0.85)
  Top 1.27: U$25.P$2 1.1,41.51 1.1,48.58 3.72,50.72 U$24.P$2 4.52,50.8 5.71,50.8 8.25,53.34 v12.78,53.34 U$23.P$5
  Bottom 1.27: U$23.P$5 v12.78,53.34
RD+
  Top 0.254: U$15.RD+ 28.29,10.77 29.53,10.77 29.75,11 29.75,17.43 29.2,17.98 29.2,21.27 29.68,21.75 30.95,21.75 31.55,22.35 C13.2
RD-
  Top 0.254: 28.02,22.96 C14.2 26.18,21.05 U$15.RD-
RDN  (via drill 0.35)
  Top 0.254: U2.5 40.82,16.69 41.67,17.54 41.67,19.54 36.42,24.79 32.76,24.79 32.41,25.15 32.41,25.25 32.17,25.49 29.22,25.49 29.13,25.4 28.57,25.4 28.09,24.92 C14.1
  Bottom 0.254: R14.2 28.09,24.55 C14.1
  other vias: 26.5,22.96 28.09,24.66
RDP
  Top 0.254: R13.2 29.73,22.96 C13.1 32.32,24.66 32.59,24.39 36.25,24.39 41.27,19.37 41.27,17.74 U2.6
RESTOMOC
  Top 1.27: R30.1 OK3.6
RESTOMOC2
  Top 1.27: R34.1 OK4.6
RST  (via drill 0.35)
  Top 0.152: v16.6,9.21 16.34,9.21 14.74,10.8 14.74,11.69 14.43,12 14.24,12 14,11.76 IC1.13 | v32.23,1.17 SW2.2
  Bottom 0.152: v16.6,9.21 18.73,9.21 | 18.73,9.21 18.84,9.21 | 18.73,9.21 20.31,7.62 24.12,7.62 26.77,4.98 26.77,4.12 27.93,2.95 J19.5 28.82,1.17 v32.23,1.17
SCK  (via drill 0.35)
  Top 0.152: IC1.9 14.18,8.57 v15.55,8.57 | U2.33 32.47,7.53 v27.93,7.53 | v27.6,6.02 26.56,4.99 26.56,4.12 25.39,2.95 J19.3
  Bottom 0.152: v15.55,8.57 16.02,8.57 16.25,8.35 18.32,8.35 19.68,6.98 21.15,6.98 22.09,6.04 23.48,6.04 24.23,5.3 24.23,4.12 25.39,2.95 J19.3 | v27.93,7.53 27.6,7.19 v27.6,6.02
SCL
  Top 0.152: U$3.SCL 17.21,18.71 16.5,18.01 15.37,18.01 14.74,17.37 14.74,16.24 IC1.18
SCSN_WIZ  (via drill 0.35)
  Top 0.152: IC1.8 17.33,4.72 17.33,2.97 17.88,2.41 20.88,2.41 21.01,2.28 21.01,1.03 21.71,0.33 33.33,0.33 34.4,1.41 R48.2 33.55,2.54 v33.33,2.54 | v32.7,8.57 34.42,10.29 U2.32
  Bottom 0.152: v33.33,2.54 33.33,3.25 33.34,3.26 33.34,3.72 32.7,4.36 v32.7,8.57
SDA
  Top 0.152: IC1.19 14.43,16.64 14.43,17.5 15.24,18.31 16.08,18.31 16.19,18.41 16.19,19.43 U$3.SDA
TDN  (via drill 0.35)
  Top 0.254: v41.59,13.97 41.59,14.53 U2.1
  Bottom 0.254: v41.59,13.97 37.68,17.87 33.55,17.87 31.11,20.32 22.32,20.32 | U$15.TD- 22.32,20.32 | 22.32,20.32 22.32,23.07 R9.1
  other vias: 26.35,27.09
TDP  (via drill 0.35)
  Top 0.254: v30.47,13.97 40.32,13.97 U2.2 | R8.1 24.44,25.63 24.14,25.33 24.14,21.96 24.96,21.14 24.96,18.59 25.67,17.87 28.23,17.87 v28.25,17.85
  Bottom 0.254: v28.25,17.85 28.45,17.65 29.53,17.65 30.47,16.71 v30.47,13.97 29.75,13.25 29.75,11 29.53,10.77 25.75,10.77 U$15.TD+
VBUS  (via drill 0.35)
  Top 0.254: C6.2 19.54,21.04 19.54,18.84 18.35,17.65 15.52,17.65 15.09,17.23 v15.09,15.56 | v13.01,6.35 13.01,7.93 13.03,7.95 13.03,8.31 IC1.7
  Top 0.305: C6.2 20.28,22.67 U1.3 19.91,24.18 19.56,24.18 19.38,24.36 19.38,25.17 19.56,25.34 19.91,25.34 U1.1
  Top 0.508: J18.1 7.16,28.29 v8.08,29.21
  Bottom 0.254: v15.09,15.56 15.09,15.15 14.48,14.54 14.48,9.63 14.31,9.46 14.31,7.65 v13.01,6.35 21.11,6.35 J19.2
  Bottom 0.508: U1.1 17.17,28.83 17.17,31.08 16.87,31.37 8.45,31.37 8.16,31.08 8.16,29.28 v8.08,29.21
  other vias: 20.28,25.71
VCCA  (via drill 0.35)
  Top 0.254: 33.77,15.67 33.16,16.28 U2.21 33.21,16.23 33.77,15.67 | U2.17 34.47,17.6 35.09,16.98 35.09,16.75 34,15.67 | U2.17 34.57,17.7 35.19,17.08 35.42,17.08 35.79,17.46 35.79,17.69 35.18,18.3 U2.15 35.23,18.45 34.67,19.02 34.67,19.25 35.01,19.59 | 35.01,19.59 34.12,20.48 | 34.12,20.48 v33.01,21.59 | v33.01,25.4 L1.2 34.76,27.2 C8.1 C18.1 C19.1 C12.1 R9.2 R8.2 | 33.77,15.67 34,15.67 | U2.4 41.07,16.23 40.51,15.67 37.78,15.67 | 37.78,15.67 34,15.67 | 34.12,20.48 34.12,20.07 33.36,19.3 33.36,18.8 34.01,18.15 34.02,18.15 U2.17 | 35.02,19.6 35.4,19.98 38.88,19.98 39.26,19.6 39.26,19.37 38.65,18.76 U2.11 | 35.02,19.6 | 35.02,19.6 35.01,19.59 | U2.8 37.78,15.67
  Bottom 0.254: v33.01,21.59 v33.01,25.4
WIZ_RST  (via drill 0.35)
  Top 0.152: IC1.22 11.23,15.56 v11.42,15.56 | v37.99,10.26 37.99,9.91 37.83,9.75 37.83,9.39 U2.37
  Bottom 0.152: v11.42,15.56 11.42,7.15 14.21,4.37 18.12,4.37 18.44,4.04 18.44,0.92 19.03,0.33 33.13,0.33 R2.1 37.8,5 37.8,6.42 37.99,6.61 v37.99,10.26
  other vias: 36.19,3.39

### Text on the board
tPlace: 12 | 4 | A0 | TX | RX | GND | GND | 3v3 | SDA | SCL | A1 | A2 | RST | 5 | 10 | 9 | 13
Document: + | + | + | + | + | +
tDocu: A5 | A4 | A3 | A2 | A1 | A0 | 9 | 10 | 11 | 12 | 13 | 0 | 1 | 2 | 3 | 4 | 5 | 6 | 7 | 8